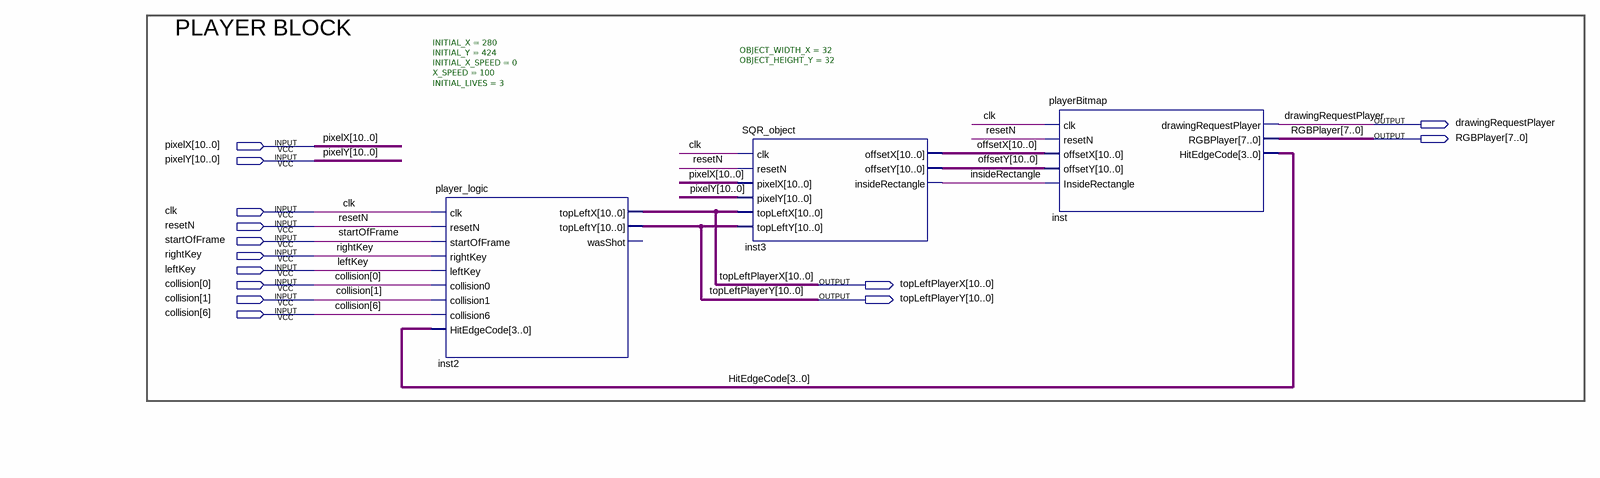
[diagram p0: schematic sheet]
// Quartus schematic Player_Block.bdf as structural Verilog: 3 symbols, 14 pins
module Player_Block (
  input  [10:0] pixelX,
  input  [10:0] pixelY,
  input  clk,
  input  resetN,
  input  startOfFrame,
  input  rightKey,
  input  leftKey,
  input  [6:0] collision,
  output drawingRequestPlayer,
  output [7:0] RGBPlayer,
  output [10:0] topLeftPlayerX,
  output [10:0] topLeftPlayerY
);

  wire insideRectangle;
  wire [3:0] HitEdgeCode;
  wire [10:0] offsetX, offsetY;

  player_logic #(.INITIAL_X(280), .INITIAL_Y(424), .INITIAL_X_SPEED(0), .X_SPEED(100), .INITIAL_LIVES(3)) inst2 (
    .clk(clk), .resetN(resetN), .startOfFrame(startOfFrame), .rightKey(rightKey), .leftKey(leftKey),
    .collision0(collision[0]), .collision1(collision[1]), .collision6(collision[6]),
    .HitEdgeCode(HitEdgeCode), .topLeftX(topLeftPlayerX), .topLeftY(topLeftPlayerY));  // open: wasShot
  SQR_object #(.OBJECT_WIDTH_X(32), .OBJECT_HEIGHT_Y(32)) inst3 (
    .clk(clk), .resetN(resetN), .pixelX(pixelX), .pixelY(pixelY), .topLeftX(topLeftPlayerX),
    .topLeftY(topLeftPlayerY), .offsetX(offsetX), .offsetY(offsetY), .insideRectangle(insideRectangle));
  playerBitmap inst (
    .clk(clk), .resetN(resetN), .offsetX(offsetX), .offsetY(offsetY), .InsideRectangle(insideRectangle),
    .drawingRequestPlayer(drawingRequestPlayer), .RGBPlayer(RGBPlayer), .HitEdgeCode(HitEdgeCode));

  // Notes on the sheet:
  //   PLAYER BLOCK
endmodule
